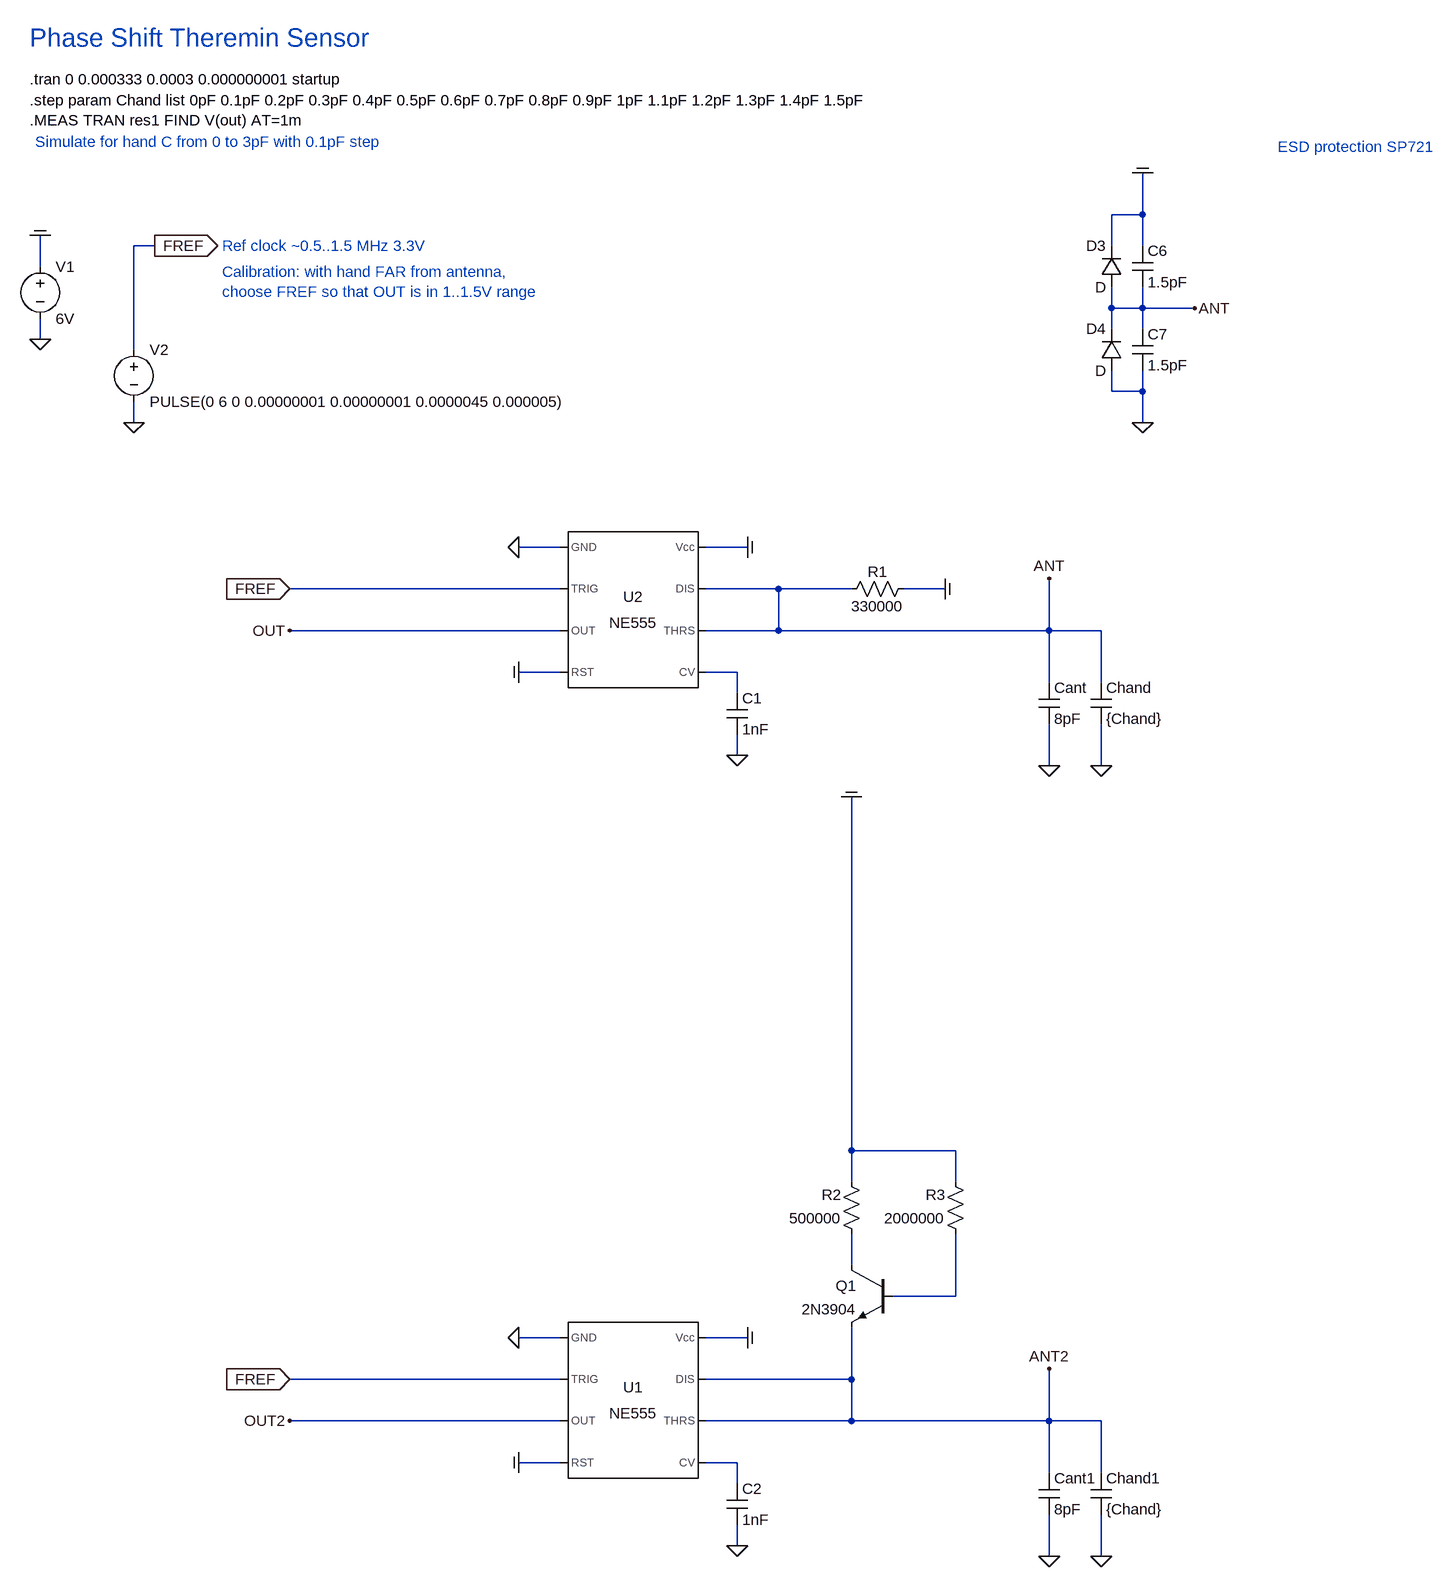
[diagram p0: schematic rc_sensor_v5.asc]
rc_sensor_v5.asc, the LTspice schematic file:
Version 4
SHEET 1 3724 1988
WIRE 1744 -96 1744 -160
WIRE 1744 -96 1696 -96
WIRE 224 -48 192 -48
WIRE 1696 -48 1696 -96
WIRE 1744 -48 1744 -96
WIRE 48 -16 48 -64
WIRE 1696 48 1696 16
WIRE 1744 48 1744 16
WIRE 1744 48 1696 48
WIRE 1824 48 1744 48
WIRE 1696 80 1696 48
WIRE 1744 80 1744 48
WIRE 48 96 48 64
WIRE 192 112 192 -48
WIRE 1696 176 1696 144
WIRE 1744 176 1744 144
WIRE 1744 176 1696 176
WIRE 192 224 192 192
WIRE 1744 224 1744 176
WIRE 848 416 784 416
WIRE 1136 416 1072 416
WIRE 848 480 432 480
WIRE 1184 480 1072 480
WIRE 1296 480 1184 480
WIRE 1440 480 1376 480
WIRE 848 544 432 544
WIRE 1184 544 1184 480
WIRE 1184 544 1072 544
WIRE 1600 544 1600 464
WIRE 1600 544 1184 544
WIRE 1680 544 1600 544
WIRE 848 608 784 608
WIRE 1120 608 1072 608
WIRE 1600 624 1600 544
WIRE 1680 624 1680 544
WIRE 1120 640 1120 608
WIRE 1120 736 1120 704
WIRE 1600 752 1600 688
WIRE 1680 752 1680 688
WIRE 1296 1344 1296 800
WIRE 1456 1344 1296 1344
WIRE 1296 1392 1296 1344
WIRE 1456 1392 1456 1344
WIRE 1296 1520 1296 1472
WIRE 1456 1568 1456 1472
WIRE 1456 1568 1360 1568
WIRE 848 1632 784 1632
WIRE 1136 1632 1072 1632
WIRE 848 1696 432 1696
WIRE 1296 1696 1296 1616
WIRE 1296 1696 1072 1696
WIRE 848 1760 432 1760
WIRE 1296 1760 1296 1696
WIRE 1296 1760 1072 1760
WIRE 1600 1760 1600 1680
WIRE 1600 1760 1296 1760
WIRE 1680 1760 1600 1760
WIRE 848 1824 784 1824
WIRE 1120 1824 1072 1824
WIRE 1600 1840 1600 1760
WIRE 1680 1840 1680 1760
WIRE 1120 1856 1120 1824
WIRE 1120 1952 1120 1920
WIRE 1600 1968 1600 1904
WIRE 1680 1968 1680 1904
FLAG 48 96 0
FLAG 224 -48 FREF
IOPIN 224 -48 Out
FLAG 192 224 0
FLAG 1600 464 ANT
FLAG 1600 752 0
FLAG 1680 752 0
FLAG 432 480 FREF
IOPIN 432 480 In
FLAG 48 -64 COM
FLAG 1744 224 0
FLAG 1744 -160 COM
FLAG 1824 48 ANT
FLAG 1136 416 COM
FLAG 784 416 0
FLAG 784 608 COM
FLAG 1120 736 0
FLAG 1440 480 COM
FLAG 432 544 OUT
FLAG 1600 1680 ANT2
FLAG 1600 1968 0
FLAG 1680 1968 0
FLAG 432 1696 FREF
IOPIN 432 1696 In
FLAG 1136 1632 COM
FLAG 784 1632 0
FLAG 784 1824 COM
FLAG 1120 1952 0
FLAG 1296 800 COM
FLAG 432 1760 OUT2
SYMBOL voltage 48 -32 R0
WINDOW 123 0 0 Left 2
WINDOW 39 0 0 Left 2
SYMATTR InstName V1
SYMATTR Value 6V
SYMBOL voltage 192 96 R0
WINDOW 123 0 0 Left 2
WINDOW 39 0 0 Left 2
SYMATTR InstName V2
SYMATTR Value PULSE(0 6 0 0.00000001 0.00000001 0.0000045 0.000005)
SYMBOL cap 1584 624 R0
SYMATTR InstName Cant
SYMATTR Value 8pF
SYMBOL cap 1664 624 R0
SYMATTR InstName Chand
SYMATTR Value {Chand}
SYMBOL res 1392 464 R90
WINDOW 0 5 56 VBottom 2
WINDOW 3 27 56 VTop 2
SYMATTR InstName R1
SYMATTR Value 330000
SYMBOL diode 1712 16 R180
WINDOW 0 24 64 Left 2
WINDOW 3 24 0 Left 2
SYMATTR InstName D3
SYMBOL diode 1712 144 R180
WINDOW 0 24 64 Left 2
WINDOW 3 24 0 Left 2
SYMATTR InstName D4
SYMBOL cap 1728 -48 R0
SYMATTR InstName C6
SYMATTR Value 1.5pF
SYMBOL cap 1728 80 R0
SYMATTR InstName C7
SYMATTR Value 1.5pF
SYMBOL NE555 960 512 R0
SYMATTR InstName U2
SYMBOL cap 1104 640 R0
SYMATTR InstName C1
SYMATTR Value 1nF
SYMBOL cap 1584 1840 R0
SYMATTR InstName Cant1
SYMATTR Value 8pF
SYMBOL cap 1664 1840 R0
SYMATTR InstName Chand1
SYMATTR Value {Chand}
SYMBOL res 1312 1488 R180
WINDOW 0 31 76 Left 2
WINDOW 3 31 40 Left 2
SYMATTR InstName R2
SYMATTR Value 500000
SYMBOL NE555 960 1728 R0
SYMATTR InstName U1
SYMBOL cap 1104 1856 R0
SYMATTR InstName C2
SYMATTR Value 1nF
SYMBOL res 1472 1488 R180
WINDOW 0 31 76 Left 2
WINDOW 3 31 40 Left 2
SYMATTR InstName R3
SYMATTR Value 2000000
SYMBOL npn 1360 1520 M0
SYMATTR InstName Q1
SYMATTR Value 2N3904
TEXT 32 -304 Left 2 !.tran 0 0.000333 0.0003 0.000000001 startup
TEXT 32 -272 Left 2 !.step param Chand list 0pF 0.1pF 0.2pF 0.3pF 0.4pF 0.5pF 0.6pF 0.7pF 0.8pF 0.9pF 1pF 1.1pF 1.2pF 1.3pF 1.4pF 1.5pF\n.MEAS TRAN res1 FIND V(out) AT=1m
TEXT 328 -48 Left 2 ;Ref clock ~0.5..1.5 MHz 3.3V
TEXT 32 -368 Left 4 ;Phase Shift Theremin Sensor
TEXT 1952 -200 Left 2 ;ESD protection SP721
TEXT 328 -8 Left 2 ;Calibration: with hand FAR from antenna,\nchoose FREF so that OUT is in 1..1.5V range
TEXT 40 -208 Left 2 ;Simulate for hand C from 0 to 3pF with 0.1pF step

The netlist it stands for:
* rc_sensor_v5.asc
V1 COM 0 6V
V2 FREF 0 PULSE(0 6 0 0.00000001 0.00000001 0.0000045 0.000005)
Cant ANT 0 8pF
Chand ANT 0 {Chand}
R1 COM ANT 330000
D3 ANT COM D
D4 0 ANT D
C6 COM ANT 1.5pF
C7 ANT 0 1.5pF
XU2 0 FREF OUT COM N001 ANT ANT COM NE555  ; pins GND TRIG OUT RST CV THRS DIS Vcc
C1 N001 0 1nF
Cant1 ANT2 0 8pF
Chand1 ANT2 0 {Chand}
R2 N002 COM 500000
XU1 0 FREF OUT2 COM N004 ANT2 ANT2 COM NE555  ; pins GND TRIG OUT RST CV THRS DIS Vcc
C2 N004 0 1nF
R3 N003 COM 2000000
Q1 N002 N003 ANT2 0 2N3904
.model D D
.lib standard.dio
.model NPN NPN
.model PNP PNP
.lib standard.bjt
.tran 0 0.000333 0.0003 0.000000001 startup
.step param Chand list 0pF 0.1pF 0.2pF 0.3pF 0.4pF 0.5pF 0.6pF 0.7pF 0.8pF 0.9pF 1pF 1.1pF 1.2pF 1.3pF 1.4pF 1.5pF
.MEAS TRAN res1 FIND V(out) AT=1m
* Ref clock ~0.5..1.5 MHz 3.3V
* Phase Shift Theremin Sensor
* ESD protection SP721
* Calibration: with hand FAR from antenna,
* choose FREF so that OUT is in 1..1.5V range
* Simulate for hand C from 0 to 3pF with 0.1pF step
.lib NE555.sub
.backanno
.end